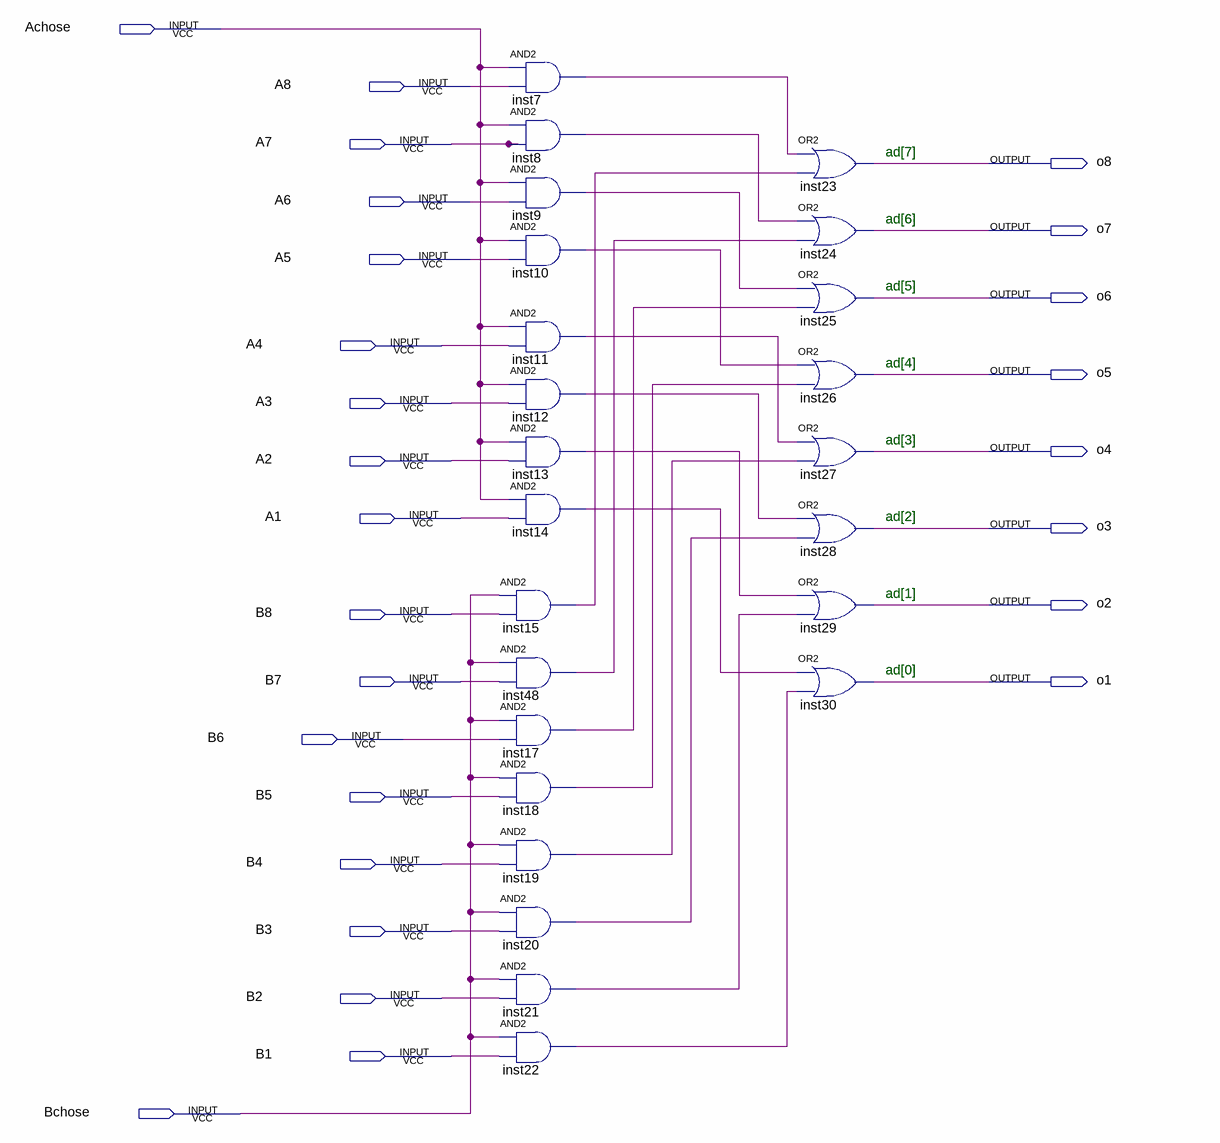
[diagram p0: schematic sheet]
// Quartus schematic 8choser.bdf as structural Verilog: 24 symbols, 26 pins
module \8choser  (
  input  Achose,
  input  A8,
  input  A7,
  input  A6,
  input  A5,
  input  A4,
  input  A3,
  input  A2,
  input  A1,
  input  B8,
  input  B7,
  input  B6,
  input  B5,
  input  B4,
  input  B3,
  input  B2,
  input  B1,
  input  Bchose,
  output o8,
  output o7,
  output o6,
  output o5,
  output o4,
  output o3,
  output o2,
  output o1
);

  wire inst7_out, inst8_out, inst9_out, inst10_out, inst11_out, inst12_out, inst13_out, inst14_out,
       inst15_out, inst17_out, inst18_out, inst19_out, inst20_out, inst21_out, inst22_out, inst48_out;

  and inst7 (inst7_out, Achose, A8);
  and inst8 (inst8_out, Achose, A7);
  and inst9 (inst9_out, Achose, A6);
  and inst10 (inst10_out, Achose, A5);
  and inst11 (inst11_out, Achose, A4);
  and inst12 (inst12_out, Achose, A3);
  and inst13 (inst13_out, Achose, A2);
  and inst14 (inst14_out, Achose, A1);
  and inst15 (inst15_out, Bchose, B8);
  and inst48 (inst48_out, Bchose, B7);
  and inst17 (inst17_out, Bchose, B6);
  and inst18 (inst18_out, Bchose, B5);
  and inst19 (inst19_out, Bchose, B4);
  and inst20 (inst20_out, Bchose, B3);
  and inst21 (inst21_out, Bchose, B2);
  and inst22 (inst22_out, Bchose, B1);
  or inst23 (o8, inst7_out, inst15_out);
  or inst24 (o7, inst8_out, inst48_out);
  or inst25 (o6, inst9_out, inst17_out);
  or inst26 (o5, inst10_out, inst18_out);
  or inst27 (o4, inst11_out, inst19_out);
  or inst28 (o3, inst12_out, inst20_out);
  or inst29 (o2, inst13_out, inst21_out);
  or inst30 (o1, inst14_out, inst22_out);

  // Other names for the same wires on the sheet: ad[7:0] = {o8, o7, o6, o5, o4, o3, o2, o1}

  // Notes on the sheet:
  //   ad[7]
  //   ad[6]
  //   ad[5]
  //   ad[4]
  //   ad[3]
  //   ad[2]
  //   ad[1]
  //   ad[0]
endmodule
